# Altium schematic sheet STM32.SchDoc
size A4; SheetNumber: 1; SheetTotal: 3
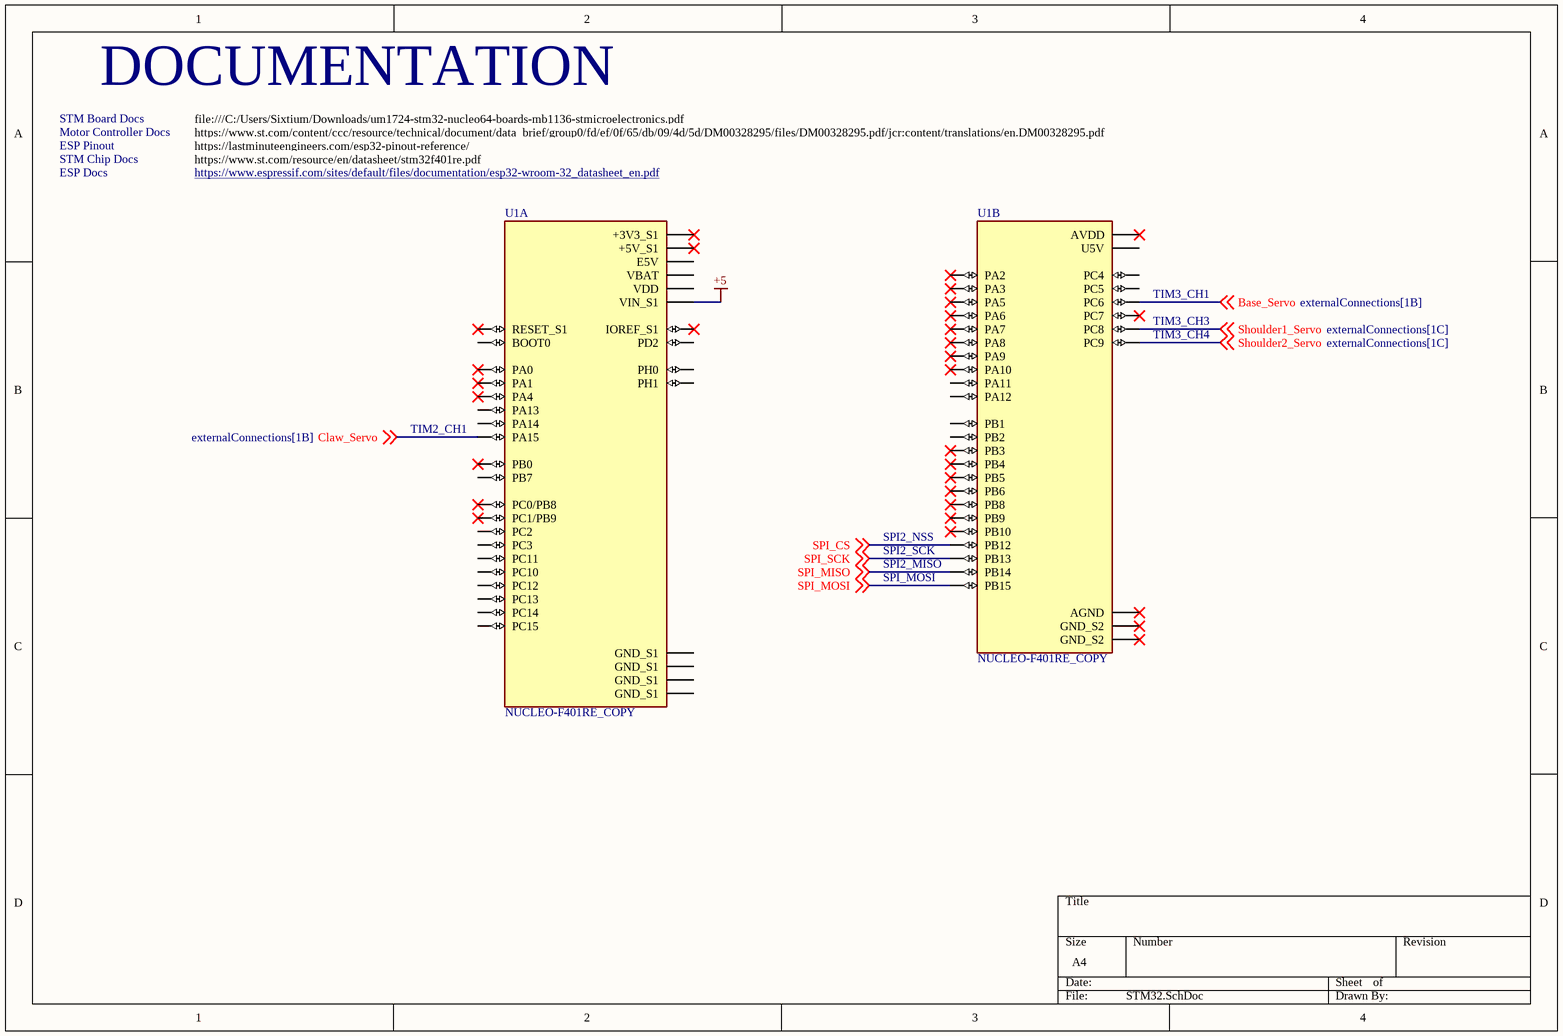
[diagram p0: STM32.SchDoc]

## Parts
U1  NUCLEO-F401RE_COPY  [ST_NUCLEO-F401RE - COPY]  (parts A,B of 2)

## Nets
+5: U1.CN7_24(VIN_S1)
Base_Servo: U1.CN10_4(PC6) ; off-sheet Base_Servo
Claw_Servo: U1.CN7_17(PA15) ; off-sheet Claw_Servo
Shoulder1_Servo: U1.CN10_2(PC8) ; off-sheet Shoulder1_Servo
Shoulder2_Servo: U1.CN10_1(PC9) ; off-sheet Shoulder2_Servo
SPI_CS: U1.CN10_16(PB12) ; off-sheet SPI_CS
SPI_MISO: U1.CN10_28(PB14) ; off-sheet SPI_MISO
SPI_MOSI: U1.CN10_26(PB15) ; off-sheet SPI_MOSI
SPI_SCK: U1.CN10_30(PB13) ; off-sheet SPI_SCK

Not connected (* = marked no-connect by the designer): U1 CN7_1(PC10) CN7_2(PC11) CN7_3(PC12) CN7_4(PD2) CN7_5(VDD) CN7_6(E5V) CN7_7(BOOT0) CN7_8(GND_S1) CN7_12(IOREF_S1)* CN7_13(PA13) CN7_14(RESET_S1)* CN7_15(PA14) CN7_16(+3V3_S1)* CN7_18(+5V_S1)* CN7_19(GND_S1) CN7_20(GND_S1) CN7_21(PB7) CN7_22(GND_S1) CN7_23(PC13) CN7_25(PC14) CN7_27(PC15) CN7_28(PA0)* CN7_29(PH0) CN7_30(PA1)* CN7_31(PH1) CN7_32(PA4)* CN7_33(VBAT) CN7_34(PB0)* CN7_35(PC2) CN7_36(PC1/PB9)* CN7_37(PC3) CN7_38(PC0/PB8)* CN10_3(PB8)* CN10_5(PB9)* CN10_6(PC5) CN10_7(AVDD)* CN10_8(U5V) CN10_9(GND_S2)* CN10_11(PA5)* CN10_12(PA12) CN10_13(PA6)* CN10_14(PA11) CN10_15(PA7)* CN10_17(PB6)* CN10_19(PC7)* CN10_20(GND_S2)* CN10_21(PA9)* CN10_22(PB2) CN10_23(PA8)* CN10_24(PB1) CN10_25(PB10)* CN10_27(PB4)* CN10_29(PB5)* CN10_31(PB3)* CN10_32(AGND)* CN10_33(PA10)* CN10_34(PC4) CN10_35(PA2)* CN10_37(PA3)*

## Notes on the sheet
- DOCUMENTATION
- STM Chip Docs
- STM Board Docs
- Motor Controller Docs
- ESP Pinout
- ESP Docs
- file:///C:/Users/Sixtium/Downloads/um1724-stm32-nucleo64-boards-mb1136-stmicroelectronics.pdf
- https://www.st.com/content/ccc/resource/technical/document/data_brief/group0/fd/ef/0f/65/db/09/4d/5d/DM00328295/files/DM00328295.pdf/jcr:content/translations/en.DM00328295.pdf
- https://lastminuteengineers.com/esp32-pinout-reference/
- https://www.st.com/resource/en/datasheet/stm32f401re.pdf
- https://www.espressif.com/sites/default/files/documentation/esp32-wroom-32_datasheet_en.pdf
- (near U1) TIM3_CH1
- (near U1) TIM3_CH3
- (near U1) TIM3_CH4
- (near U1) TIM2_CH1
- (near U1) SPI2_NSS
- (near U1) SPI2_SCK
- (near U1) SPI2_MISO
- (near U1) SPI_MOSI

## Library data of the parts
U1 = NUCLEO-F401RE_COPY: STM32 Nucleo-64 development board with STM32F401RET6 MCU, supports Arduino and ST morpho connectivity; Availability: Unavailable; Price: None; Package: None; MP: NUCLEO-F401RE; Value: *